# Altium schematic sheet ESPCamConnecter.SchDoc
size A4
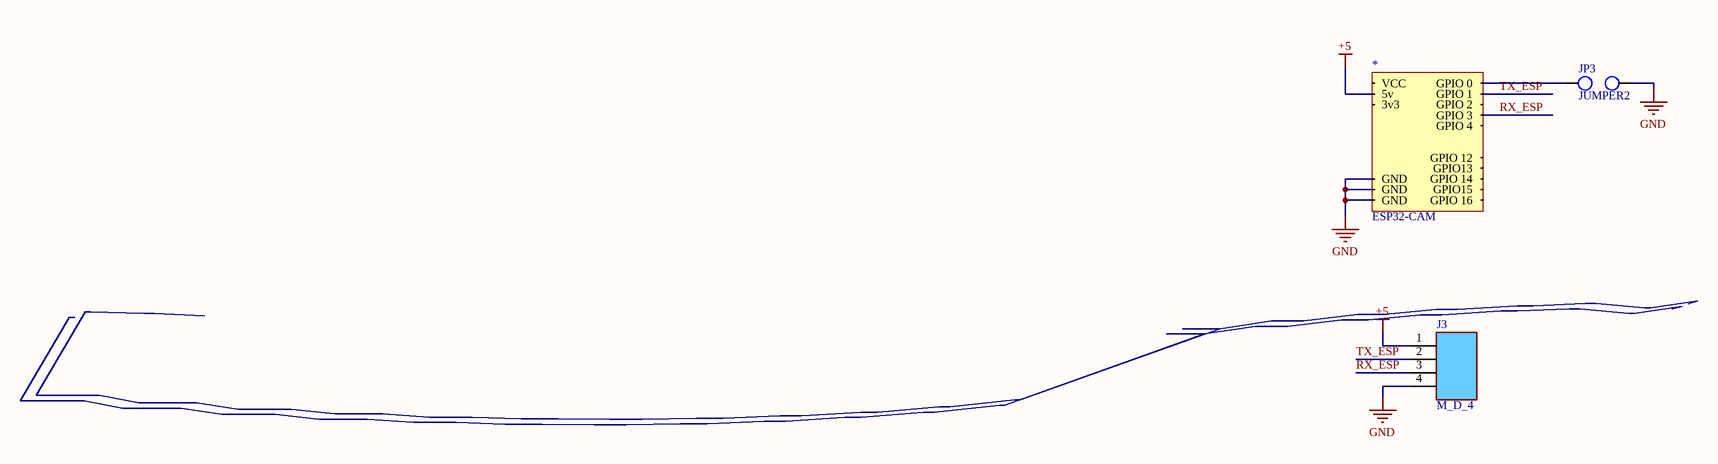
[diagram p0: ESPCamConnecter.SchDoc]

## Parts
*  ESP32-CAM  [ESP32-CAM]
J3  Type: M_D_4  [BARRETTE_4_M_D]  (hidden comment: BARRETTE_4 CONTACTS_1 RANGEE_MALE_DROITE)
JP3  JUMPER2  [BARRETTE_2_M_D]

## Nets
+5: *.9(5v) J3.1
GND: *.4(GND) *.8(GND) *.10(GND) J3.4 JP3.2
RX_ESP: *.6(GPIO_3) J3.3
TX_ESP: *.7(GPIO_1) J3.2
Net*_3: *.3(GPIO_0) JP3.1

Not connected (* = marked no-connect by the designer): * 1(3v3) 2(GPIO_16) 5(VCC) 11(GPIO_12) 12(GPIO13) 13(GPIO15) 14(GPIO_14) 15(GPIO_2) 16(GPIO_4)

## Library data of the parts
J3 = BARRETTE_4 CONTACTS_1 RANGEE_MALE_DROITE: BARRETTE 4 CONTACTS 1 RANGEE MALE DROITE
JP3 = JUMPER2: BARRETTE 2 CONTACTS 1 RANGEE MALE DROITE; Type: JUMPER2